# EAGLE design 0HP AND Gate REV 1 (EAGLE 7.6.0)
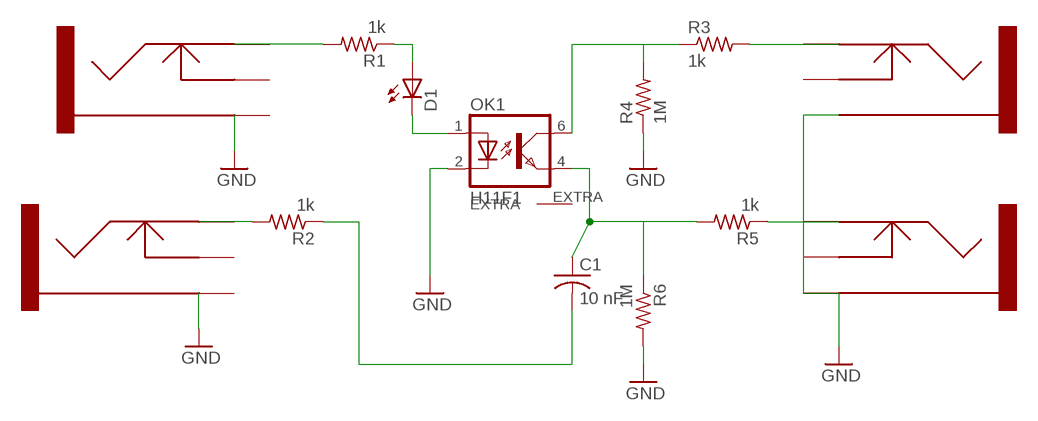
[diagram p0: schematic, sheet 1]

## Parts
C1  10 nF  C-US025-024X044  [C025-024X044]
CV1  3.5MMJACK  [3.5MMPHONEJACK]
CV2  3.5MMJACK  [3.5MMPHONEJACK]
D1  LED3MM  [LED3MM]
IN  3.5MMJACK  [3.5MMPHONEJACK]
OK1  H11F1  [DIL05]
OUT  3.5MMJACK  [3.5MMPHONEJACK]
R1  1k  R-US_0207/2V  [0207/2V]
R2  1k  R-US_0207/2V  [0207/2V]
R3  1k  R-US_0207/2V  [0207/2V]
R4  1M  R-US_0207/2V  [0207/2V]
R5  1k  R-US_0207/2V  [0207/2V]
R6  1M  R-US_0207/2V  [0207/2V]

## Nets
GND: CV1.SLEEVE CV2.SLEEVE IN.SLEEVE OK1.2(C) OUT.SLEEVE R4.1 R6.2
N$1: CV2.TIP R1.2
N$2: D1.A R1.1
N$3: D1.K(C) OK1.1(A)
N$4: CV1.TIP R2.2
N$5: C1.2 R2.1
N$8: C1.1 OK1.4(EMIT) R5.2 R6.1
N$9: OK1.6(COL) R3.1 R4.2
N$10: IN.TIP R5.1
N$11: OUT.TIP R3.2
Unconnected: CV1.SWITCH CV2.SWITCH IN.SWITCH OK1.EXTRA OUT.SWITCH

## Library data of the parts
C1 = rcl:C-US: CAPACITOR, American symbol
CV1 CV2 IN OUT = elipech_modified:3.5MMJACK
D1 = led:LED: LED OSRAM: - CHIPLED LG R971, LG N971, LY N971, LG Q971, LY Q971, LO R971, LY R971 LH N974, LH R974 LS Q976, LO Q976, LY Q976 LO Q996 - Hyper CHIPLED LW Q18S LB Q993, LB Q99A, LB R99A - SideLED LS A670, LO A670, LY A670, LG A670, LP A670 LB A673, LV A673, LT A673, LW A673 LH A674 LY A675 LS A676, LA A676, LO A676, LY A676, LW A676 LS A679, LY A679, LG A679 - Hyper Micro SIDELED® LS Y876, LA Y876, LO Y876, LY Y876 LT Y87S - SmartLED LW L88C, LW L88S LB L89C, LB L89S, LG L890 LS L89K, LO L89K, LY L89K LS L896, LA L896, LO L896, LY L896 - TOPLED LS T670, LO T670, LY T670, LG T670, LP T670 LSG T670, LSP T670, LSY T670, LOP T670, LYG T670 LG T671, LOG T671, LSG T671 LB T673, LV T673, LT T673, LW T673 LH T674 LS T676, LA T676, LO T676, LY T676, LB T676, LH T676, LSB T676, LW T676 LB T67C, LV T67C, LT T67C, LS T67K, LO T67K, LY T67K, LW E67C LS E67B, LA E67B, LO E67B, LY E67B, LB E67C, LV E67C, LT E67C LW T67C LS T679, LY T679, LG T679 LS T770, LO T770, LY T770, LG T770, LP T770 LB T773, LV T773, LT T773, LW T773 LH T774 LS E675, LA E675, LY E675, LS T675 LS T776, LA T776, LO T776, LY T776, LB T776 LHGB T686 LT T68C, LB T68C - Hyper Mini TOPLED® LB M676 - Mini TOPLED Santana® LG M470 LS M47K, LO M47K, LY M47K Source: http://www.osram.convergy.de LUXEON: - LUMILED® LXK2-PW12-R00, LXK2-PW12-S00, LXK2-PW14-U00, LXK2-PW14-V00 LXK2-PM12-R00, LXK2-PM12-S00, LXK2-PM14-U00 LXK2-PE12-Q00, LXK2-PE12-R00, LXK2-PE12-S00, LXK2-PE14-T00, LXK2-PE14-U00 LXK2-PB12-K00, LXK2-PB12-L00, LXK2-PB12-M00, LXK2-PB14-N00, LXK2-PB14-P00, LXK2-PB14-Q00 LXK2-PR12-L00, LXK2-PR12-M00, LXK2-PR14-Q00, LXK2-PR14-R00 LXK2-PD12-Q00, LXK2-PD12-R00, LXK2-PD12-S00 LXK2-PH12-R00, LXK2-PH12-S00 LXK2-PL12-P00, LXK2-PL12-Q00, LXK2-PL12-R00 Source: www.luxeon.com KINGBRIGHT: KA-3528ASYC Source: www.kingbright.com
OK1 = optocoupler:H11F1: OPTO COUPLER OPTO COUPLER; OC_FARNELL: unknown; OC_NEWARK: unknown
R1-R6 = resistor:R-US_: RESISTOR, American symbol

## Board
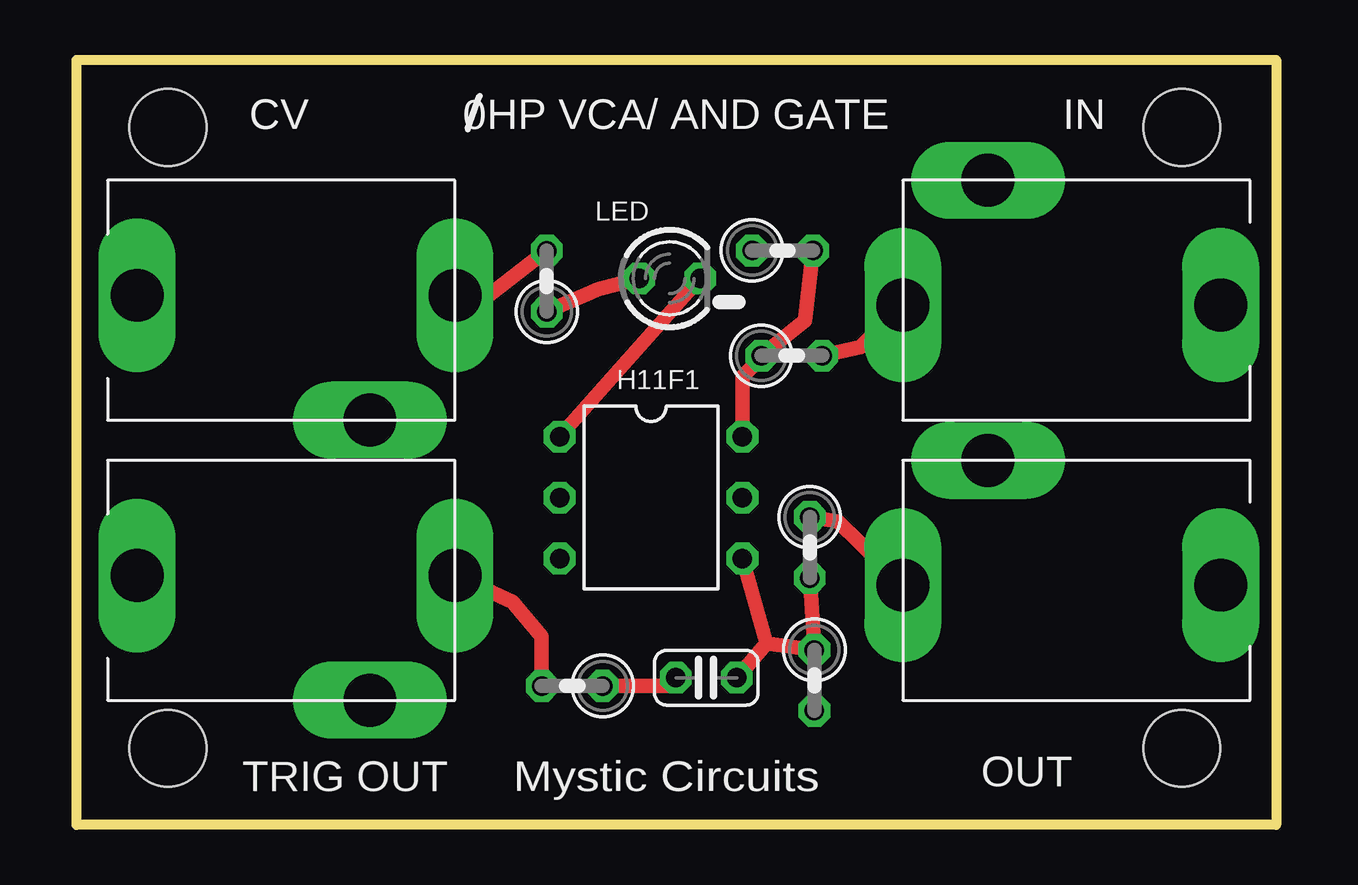
[diagram p1: board, top side]
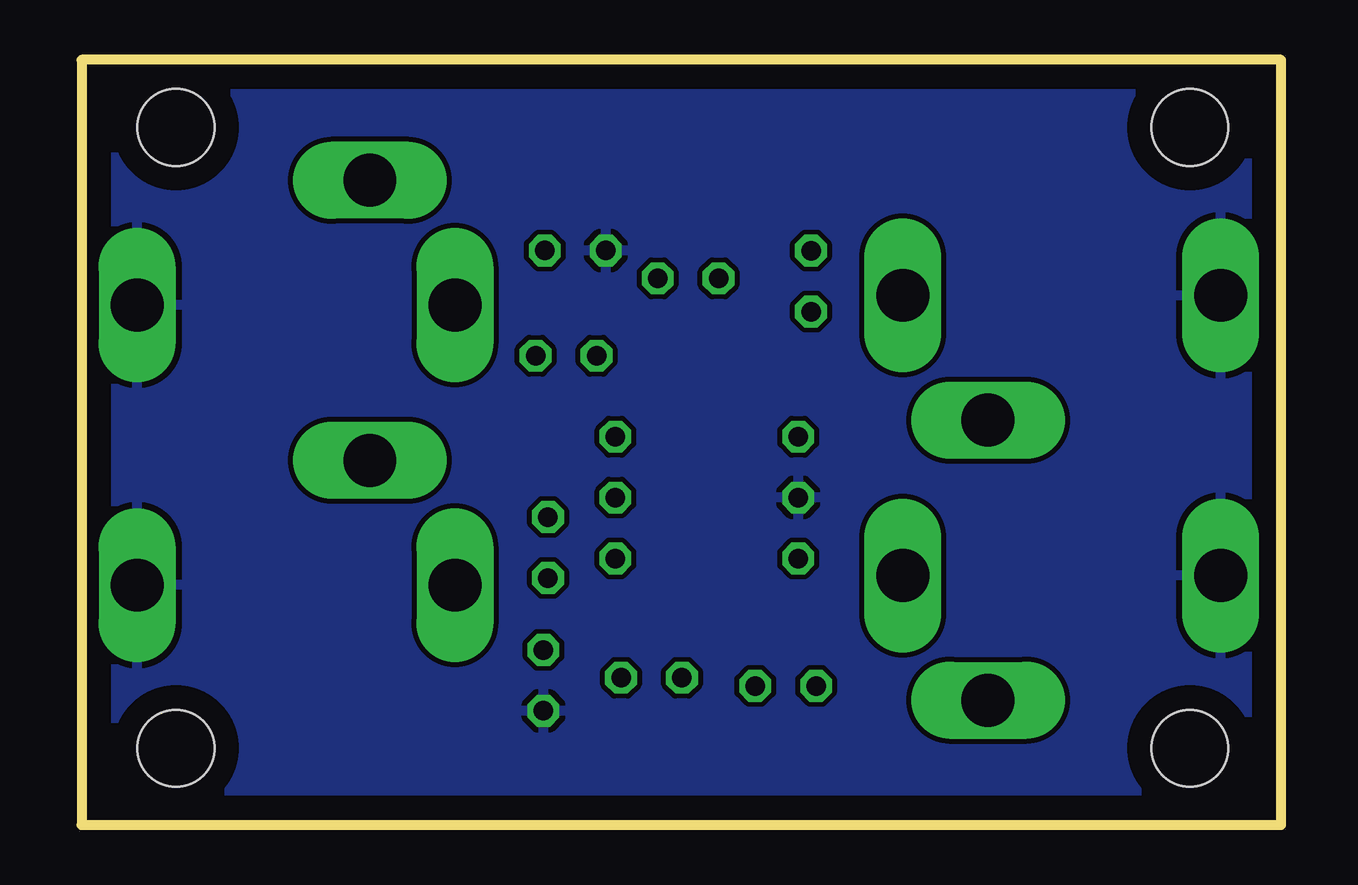
[diagram p2: board, bottom side, seen from below]

Size 50 x 31.89 mm. Coordinates in mm from the lower left corner, seen from the top.
Outline: 0,0 0,31.89 50,31.89 50,0 0,0
Copper layers (1*16): Top 0.035mm / dielectric 1.5mm / Bottom 0.035mm
Design rules "default": minimum track width 10mil, minimum drill 24mil, track to track 8mil, track to pad 8mil, pad to pad 8mil, via to via 8mil, smd to smd 8mil, copper to edge 40mil, drill to drill 8mil, minimum pad ring 10mil, minimum via ring 8mil, stop-mask expansion 4mil, vias tented up to drill 0mil, thermal gap 10mil
Holes 3.2 mm at 3.81,3.2 46.08,3.2 46.08,29.08 3.81,29.08

### Footprints (pad centres in the part's own frame; a part is rotated, then mirrored left to right if it is on the bottom)
C025-024X044 = drill 0.813 octagon: 1 -1.27,0; 2 1.27,0
3.5MMPHONEJACK = drill 2.2 pad 2.54 long: SLEEVE -5,0.2; SWITCH 4.7,-5; TIP 8.25,0.2
LED3MM = drill 0.813 octagon: A -1.27,0; K 1.27,0
DIL05 = drill 0.813 octagon: 1 -2.54,-3.81; 2 0,-3.81; 3 2.54,-3.81; 4 2.54,3.81; 6 -2.54,3.81; EXTRA 0,3.81
0207/2V = drill 0.813 octagon: 1 -1.27,0; 2 1.27,0

### Placement (x,y rotation side)
C1  26.25,6.14 180 top
CV1  7.53,10.2 0 top
CV2  7.53,21.88 0 top
D1  24.73,22.79 0 top
IN  42.69,10.2 180 top
OK1  23.95,13.65 270 top
OUT  42.69,21.88 180 top
R1  19.6,22.68 90 top
R2  20.66,5.8 180 top
R3  29.81,19.57 0 top
R4  29.43,23.95 0 top
R5  30.57,11.57 270 top
R6  30.75,6.03 270 top

### Tracks (layer width: path | path; a pad name or v marks a point on that pad's centre or on a via)
GND
  pour Bottom: 0.28,0.14 0,31.87 50,31.62 50,0
N$1
  Top 0.61: CV2.TIP 16.98,21.93 R1.2
N$2
  Top 0.61: R1.1 21.75,22.34 D1.A
N$3
  Top 0.61: D1.K OK1.1
N$4
  Top 0.61: CV1.TIP 18.18,9.3 19.39,7.86 R2.2
N$5
  Top 0.61: R2.1 24.64,5.8 C1.2
N$8
  Top 0.61: 28.75,7.57 R6.1 R5.2 | 28.75,7.57 OK1.4 | C1.1 28.75,7.57
N$9
  Top 0.406: R3.1 28.97,19.91
  Top 0.61: R4.2 30.36,21.03 28.97,19.91 27.75,18.7 OK1.6
N$10
  Top 0.61: IN.TIP 31.75,12.66 R5.1
N$11
  Top 0.61: R3.2 32.67,19.92 OUT.TIP

### Text on the board
tPlace: CV | 0HP VCA/ AND GATE | IN | LED | H11F1 | OUT | TRIG OUT | Mystic Circuits